# EAGLE design v1_E7 (EAGLE 7.7.0)

## Sheet 1 of 5: Atmega328p
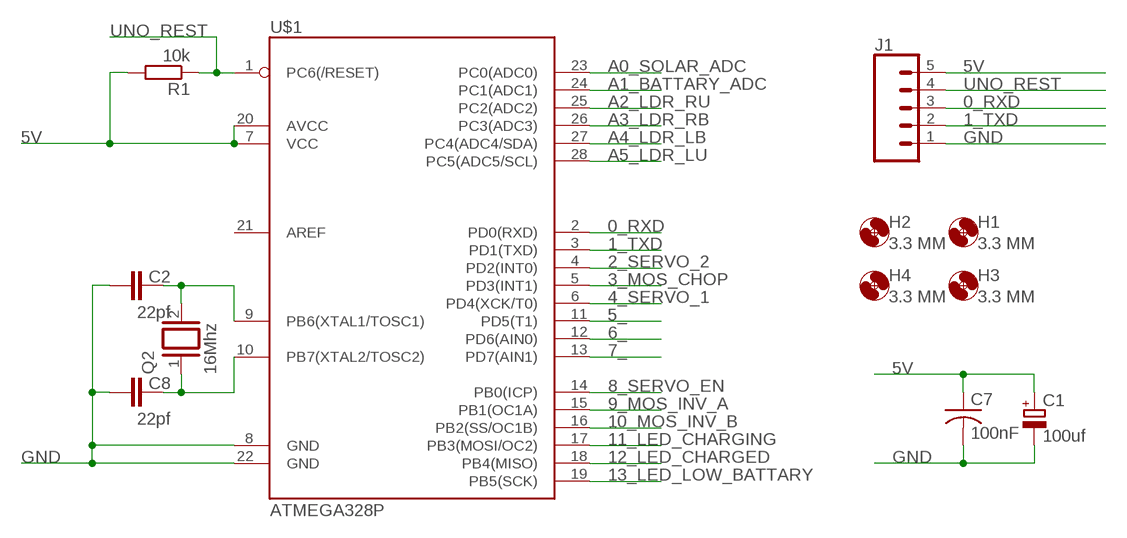
[diagram p0: schematic, sheet 1]

### Parts
C1  100uf  CPOL-EUE3.5-8  [E3,5-8]
C2  22pf  C-EU050-030X075  [C050-030X075]
C7  100nF  C-US050-035X075  [C050-035X075]
C8  22pf  C-EU050-030X075  [C050-030X075]
H1  3.3 MM  MOUNT-HOLE3.3  [3,3]
H2  3.3 MM  MOUNT-HOLE3.3  [3,3]
H3  3.3 MM  MOUNT-HOLE3.3  [3,3]
H4  3.3 MM  MOUNT-HOLE3.3  [3,3]
J1  CONN_05JST-VERT  [JST-5-PTH-VERT]
Q2  16Mhz  XTAL/S  [QS]
R1  10k  R-EU_0207/10  [0207/10]
U$1  ATMEGA328P  ATMEGA328P_PDIP  [DIL-28-3]

### Nets
0_RXD: J1.3 U$1.2(PD0(RXD))
1_TXD: J1.2 U$1.3(PD1(TXD))
2_SERVO_2: U$1.4(PD2(INT0)) ; also sheet 5
3_MOS_CHOP: U$1.5(PD3(INT1)) ; also sheet 3
4_SERVO_1: U$1.6(PD4(XCK/T0)) ; also sheet 5
5_: U$1.11(PD5(T1))
5V: C1.+ C7.1 J1.5 R1.2 U$1.7(VCC) U$1.20(AVCC) ; also sheet 2,5
6_: U$1.12(PD6(AIN0))
7_: U$1.13(PD7(AIN1))
8_SERVO_EN: U$1.14(PB0(ICP)) ; also sheet 5
9_MOS_INV_A: U$1.15(PB1(OC1A)) ; also sheet 4
10_MOS_INV_B: U$1.16(PB2(SS/OC1B)) ; also sheet 4
11_LED_CHARGING: U$1.17(PB3(MOSI/OC2)) ; also sheet 5
12_LED_CHARGED: U$1.18(PB4(MISO)) ; also sheet 5
13_LED_LOW_BATTARY: U$1.19(PB5(SCK)) ; also sheet 5
A0_SOLAR_ADC: U$1.23(PC0(ADC0)) ; also sheet 3
A1_BATTARY_ADC: U$1.24(PC1(ADC1)) ; also sheet 3
A2_LDR_RU: U$1.25(PC2(ADC2)) ; also sheet 5
A3_LDR_RB: U$1.26(PC3(ADC3)) ; also sheet 5
A4_LDR_LB: U$1.27(PC4(ADC4/SDA)) ; also sheet 5
A5_LDR_LU: U$1.28(PC5(ADC5/SCL)) ; also sheet 5
GND: C1.- C2.1 C7.2 C8.1 J1.1 U$1.8(GND) U$1.22(GND) ; also sheet 2,3,4,5
N$1: C2.2 Q2.2 U$1.9(PB6(XTAL1/TOSC1))
N$4: C8.2 Q2.1 U$1.10(PB7(XTAL2/TOSC2))
UNO_REST: J1.4 R1.1 U$1.1(PC6(/RESET))
Unconnected: U$1.21(AREF)

## Sheet 2 of 5: Voltage regulation
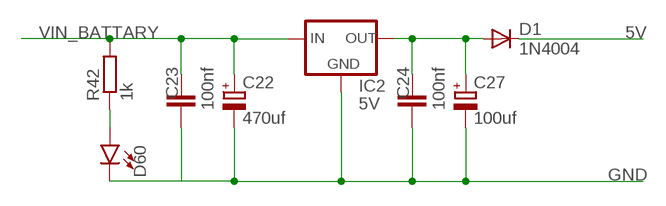
[diagram p1: schematic, sheet 2]

### Parts
C22  470uf  CPOL-EUE3.5-8  [E3,5-8]
C23  100nf  C-EU050-030X075  [C050-030X075]
C24  100nf  C-EU050-030X075  [C050-030X075]
C27  100uf  CPOL-EUE3.5-8  [E3,5-8]
D1  1N4004  [DO41-10]
D60  LED5MM  [LED_5MM]
IC2  5V  V_REG_78XXSIDE  [78XXL]
R42  1k  R-EU_0207/10  [0207/10]

### Nets
5V: D1.C ; also sheet 1,5
GND: C22.- C23.1 C24.1 C27.- D60.K(C) IC2.GND ; also sheet 1,3,4,5
N$13: C24.2 C27.+ D1.A IC2.OUT
N$74: D60.A R42.1
VIN_BATTARY: C22.+ C23.2 IC2.IN R42.2 ; also sheet 3,4,5

## Sheet 3 of 5: Buck_Boost Charging
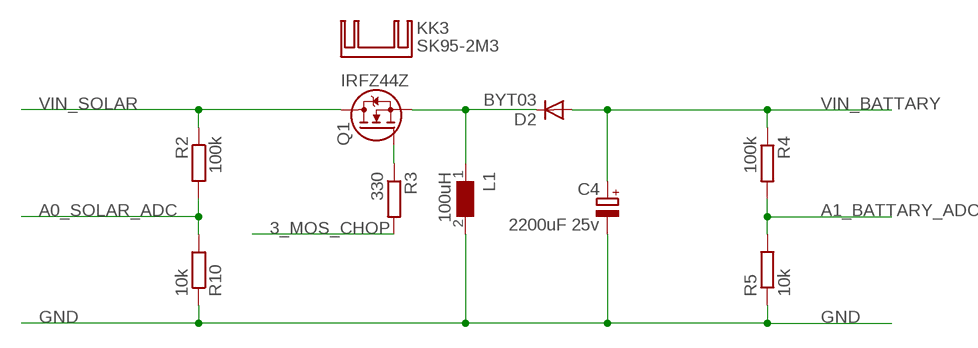
[diagram p2: schematic, sheet 3]

### Parts
C4  2200uF 25v  CPOL-EUE5-13  [E5-13]
D2  BYT03  [DO27-15]
KK3  SK95-2M3  [SK95-2M3]
L1  100uH  WE-ZB  [WE-ZB]
Q1  IRFZ44Z  [TO220V]
R2  100k  R-EU_0207/10  [0207/10]
R3  330  R-EU_0207/10  [0207/10]
R4  100k  R-EU_0207/10  [0207/10]
R5  10k  R-EU_0207/10  [0207/10]
R10  10k  R-EU_0207/10  [0207/10]

### Nets
3_MOS_CHOP: R3.2 ; also sheet 1
A0_SOLAR_ADC: R2.2 R10.2 ; also sheet 1
A1_BATTARY_ADC: R4.2 R5.2 ; also sheet 1
GND: C4.- L1.2 R5.1 R10.1 ; also sheet 1,2,4,5
N$2: D2.C L1.1 Q1.3(S)
N$3: Q1.1(G) R3.1
VIN_BATTARY: C4.+ D2.A R4.1 ; also sheet 2,4,5
VIN_SOLAR: Q1.2(D) R2.1 ; also sheet 5

## Sheet 4 of 5: Inverter
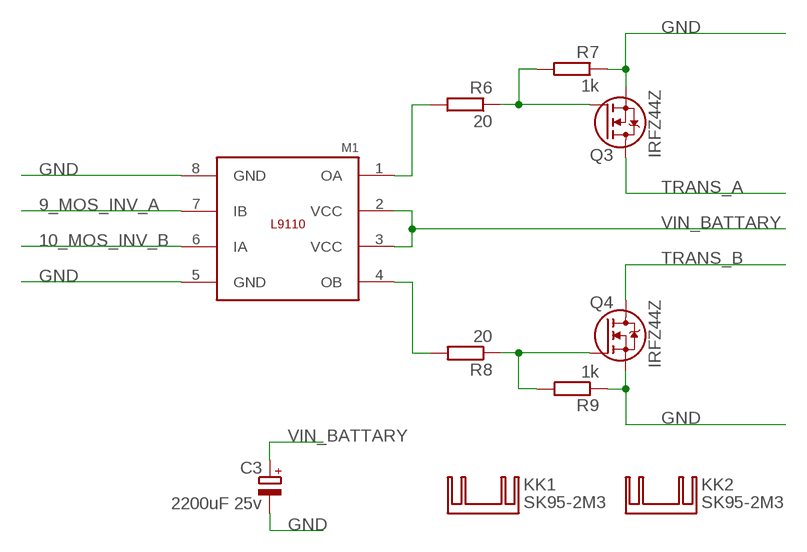
[diagram p3: schematic, sheet 4]

### Parts
C3  2200uF 25v  CPOL-EUE5-13  [E5-13]
KK1  SK95-2M3  [SK95-2M3]
KK2  SK95-2M3  [SK95-2M3]
M1  L9110  [SO8P]
Q3  IRFZ44Z  [TO220V]
Q4  IRFZ44Z  [TO220V]
R6  20  R-EU_0207/10  [0207/10]
R7  1k  R-EU_0207/10  [0207/10]
R8  20  R-EU_0207/10  [0207/10]
R9  1k  R-EU_0207/10  [0207/10]

### Nets
9_MOS_INV_A: M1.7(IB) ; also sheet 1
10_MOS_INV_B: M1.6(IA) ; also sheet 1
GND: C3.- M1.5(GND) M1.8(GND) Q3.3(S) Q4.3(S) R7.1 R9.1 ; also sheet 1,2,3,5
N$5: Q3.1(G) R6.1 R7.2
N$7: M1.4(OB) R8.2
N$8: Q4.1(G) R8.1 R9.2
N$11: M1.1(OA) R6.2
TRANS_A: Q3.2(D) ; also sheet 5
TRANS_B: Q4.2(D) ; also sheet 5
VIN_BATTARY: C3.+ M1.2(VCC) M1.3(VCC) ; also sheet 2,3,5

## Sheet 5 of 5: Terminals
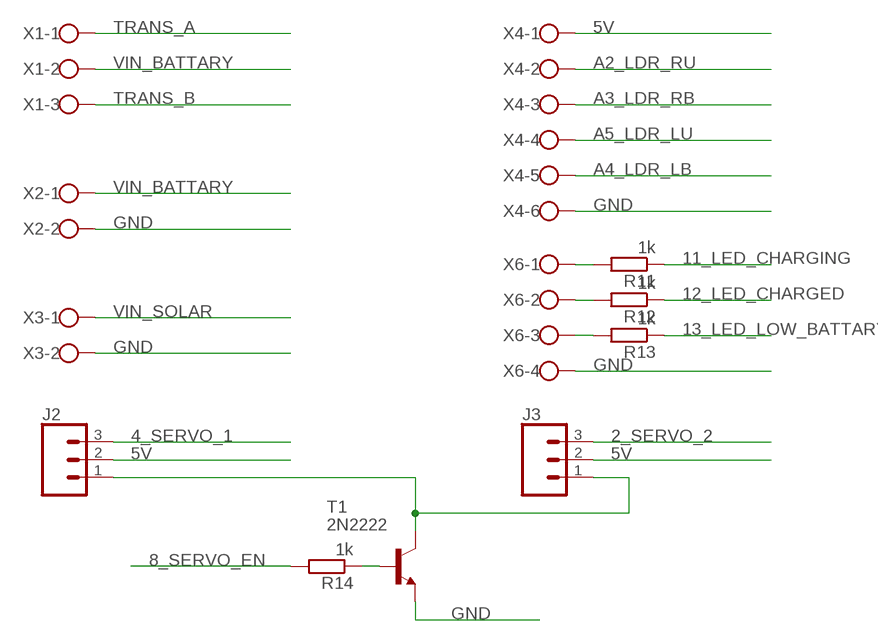
[diagram p4: schematic, sheet 5]

### Parts
J2  CONN_03JST-PTH-VERT  [JST-3-PTH-VERT]
J3  CONN_03JST-PTH-VERT  [JST-3-PTH-VERT]
R11  1k  R-EU_0207/10  [0207/10]
R12  1k  R-EU_0207/10  [0207/10]
R13  1k  R-EU_0207/10  [0207/10]
R14  1k  R-EU_0207/10  [0207/10]
T1  2N2222  [TO92-EBC-OVAL]
X1  W237-103  [W237-103]
X2  W237-102  [W237-102]
X3  W237-102  [W237-102]
X4  W237-6  [W237-6]
X6  W237-4  [W237-4]

### Nets
2_SERVO_2: J3.3 ; also sheet 1
4_SERVO_1: J2.3 ; also sheet 1
5V: J2.2 J3.2 X4.1 ; also sheet 1,2
8_SERVO_EN: R14.2 ; also sheet 1
11_LED_CHARGING: R11.1 ; also sheet 1
12_LED_CHARGED: R12.1 ; also sheet 1
13_LED_LOW_BATTARY: R13.1 ; also sheet 1
A2_LDR_RU: X4.2 ; also sheet 1
A3_LDR_RB: X4.3 ; also sheet 1
A4_LDR_LB: X4.5 ; also sheet 1
A5_LDR_LU: X4.4 ; also sheet 1
GND: T1.E X2.2 X3.2 X4.6 X6.4 ; also sheet 1,2,3,4
N$9: R13.2 X6.3
N$10: R12.2 X6.2
N$12: R11.2 X6.1
N$16: R14.1 T1.B
N$17: J2.1 J3.1 T1.C
TRANS_A: X1.1 ; also sheet 4
TRANS_B: X1.3 ; also sheet 4
VIN_BATTARY: X1.2 X2.1 ; also sheet 2,3,4
VIN_SOLAR: X3.1 ; also sheet 3

## Library data of the parts
C1 C22 C27 = rcl:CPOL-EU: POLARIZED CAPACITOR, European symbol
C2 C8 C23 C24 = rcl:C-EU: CAPACITOR, European symbol
C3 C4 = rcl@1:CPOL-EU: POLARIZED CAPACITOR, European symbol; SPICEPREFIX: C
C7 = rcl@1:C-US: CAPACITOR, American symbol; SPICEPREFIX: C
D1 = adafruit:1N4004: DIODE General purpose 1N400x type rectifier (With bigger pads) http://www.ladyada.net/library/pcb/eaglelibrary.html
D2 = diode:BYT03: DIODE ultra fast
D60 = SparkFun-LED:LED: LED (Generic) Standard schematic elements and footprints for 5mm, 3mm, 1206, and 0603 sized LEDs. Generic LEDs with no color specified.
H1-H4 = holes:MOUNT-HOLE: MOUNTING HOLE with drill center marker
IC2 = SparkFun:V_REG_78XX: Voltage Regulator Standard 7805 5V regulator. IGO (Input Ground Output). Spark Fun Electronics SKU : COM-00107
J1 = SparkFun-Connectors:CONN_05: Multi connection point. Often used as Generic Header-pin footprint for 0.1 inch spaced/style header connections On any of the 0.1 inch spaced packages, you can populate with these: Break Away Headers - Straight <https://www.sparkfun.com/products/116> (PRT-00116) Break Away Male Headers - Right Angle <https://www.sparkfun.com/products/553> (PRT-00553) Female Headers <https://www.sparkfun.com/products/115> (PRT-00115) Break Away Headers - Machine Pin <https://www.sparkfun.com/products/117> (PRT-00117) Break Away Female Headers - Swiss Machine Pin <https://www.sparkfun.com/products/743> (PRT-00743) For SCREWTERMINALS and SPRING TERMINALS visit here: Screw Terimnals on SparkFun.com <https://www.sparkfun.com/search/results?term=Screw+Terminals> (5mm/3.5mm/2.54mm spacing) This device is also useful as a general connection point to wire up your design to another part of your project. Our various solder wires solder well into these plated through hole pads. Hook-Up Wire - Assortment (Stranded, 22 AWG) <https://www.sparkfun.com/products/11375> (PRT-11375) Hook-Up Wire - Assortment (Solid Core, 22 AWG) <https://www.sparkfun.com/products/11367> (PRT-11367) View the entire wire category on our website here <https://www.sparkfun.com/categories/141> Special notes: Molex polarized connector foot print use with SKU : PRT-08231 with associated crimp pins and housings. 1MM SMD Version SKU: PRT-10208
J2 J3 = SparkFun-Connectors:CONN_03: Multi connection point. Often used as Generic Header-pin footprint for 0.1 inch spaced/style header connections On any of the 0.1 inch spaced packages, you can populate with these: Break Away Headers - Straight <https://www.sparkfun.com/products/116> (PRT-00116) Break Away Male Headers - Right Angle <https://www.sparkfun.com/products/553> (PRT-00553) Female Headers <https://www.sparkfun.com/products/115> (PRT-00115) Break Away Headers - Machine Pin <https://www.sparkfun.com/products/117> (PRT-00117) Break Away Female Headers - Swiss Machine Pin <https://www.sparkfun.com/products/743> (PRT-00743) Stackable Header - 3 Pin (Female, 0.1") <https://www.sparkfun.com/products/13875> (PRT-13875) For SCREWTERMINALS and SPRING TERMINALS visit here: Screw Terimnals on SparkFun.com <https://www.sparkfun.com/search/results?term=Screw+Terminals> (5mm/3.5mm/2.54mm spacing) This device is also useful as a general connection point to wire up your design to another part of your project. Our various solder wires solder well into these plated through hole pads. Hook-Up Wire - Assortment (Stranded, 22 AWG) <https://www.sparkfun.com/products/11375> (PRT-11375) Hook-Up Wire - Assortment (Solid Core, 22 AWG) <https://www.sparkfun.com/products/11367> (PRT-11367) View the entire wire category on our website here <https://www.sparkfun.com/categories/141> Special notes: Molex polarized connector foot print use with SKU : PRT-08232 with associated crimp pins and housings.; PROD_ID: CONN-13230
KK1-KK3 = heatsink:SK95-2M3: HEATSINK manufacturer Fischer/distributor Buerklin
L1 = wuerth_elektronik_eisos__v6.5:WE-ZB: Leaded Line Chokes WE-ZB - low leakage field because of the ring core - Delivery on a strap for easy assembly on the printed circuit board - Advanrage in comparison to the 6-hole ferrite bead is that you have a higher data safety in transmission because of aligned base inductance -- Particularly suitable for video signals -- Broadband screening -- Use in computer periphery devices such as scanners, modems, ect.
M1 = FaBo-Motor:L9110
Q1 Q3 Q4 = semiconductor:IRFZ44Z: Automotive MOSFET VDSS = 55V RDS(on) = 13.9mOhm ID = 51A
Q2 = special:XTAL/S: CRYSTAL
R1-R14 R42 = rcl:R-EU_: RESISTOR, European symbol
T1 = adafruit:2N2222: NPN TRANSISTOR Big oval pads
U$1 = FaBo-MPU:ATMEGA328P_PDIP
X1 = con-wago-500:W237-103: WAGO SCREW CLAMP; MPN: 237-103; OC_FARNELL: unknown; OC_NEWARK: 18M7116
X2 X3 = con-wago-500:W237-102: WAGO SCREW CLAMP; MPN: 237-102; OC_FARNELL: unknown; OC_NEWARK: 70K9898
X4 = con-wago-500:W237-6: WAGO SCREW CLAMP; OC_FARNELL: unknown; OC_NEWARK: unknown
X6 = con-wago-500:W237-4: WAGO SCREW CLAMP; OC_FARNELL: unknown; OC_NEWARK: unknown

## Board
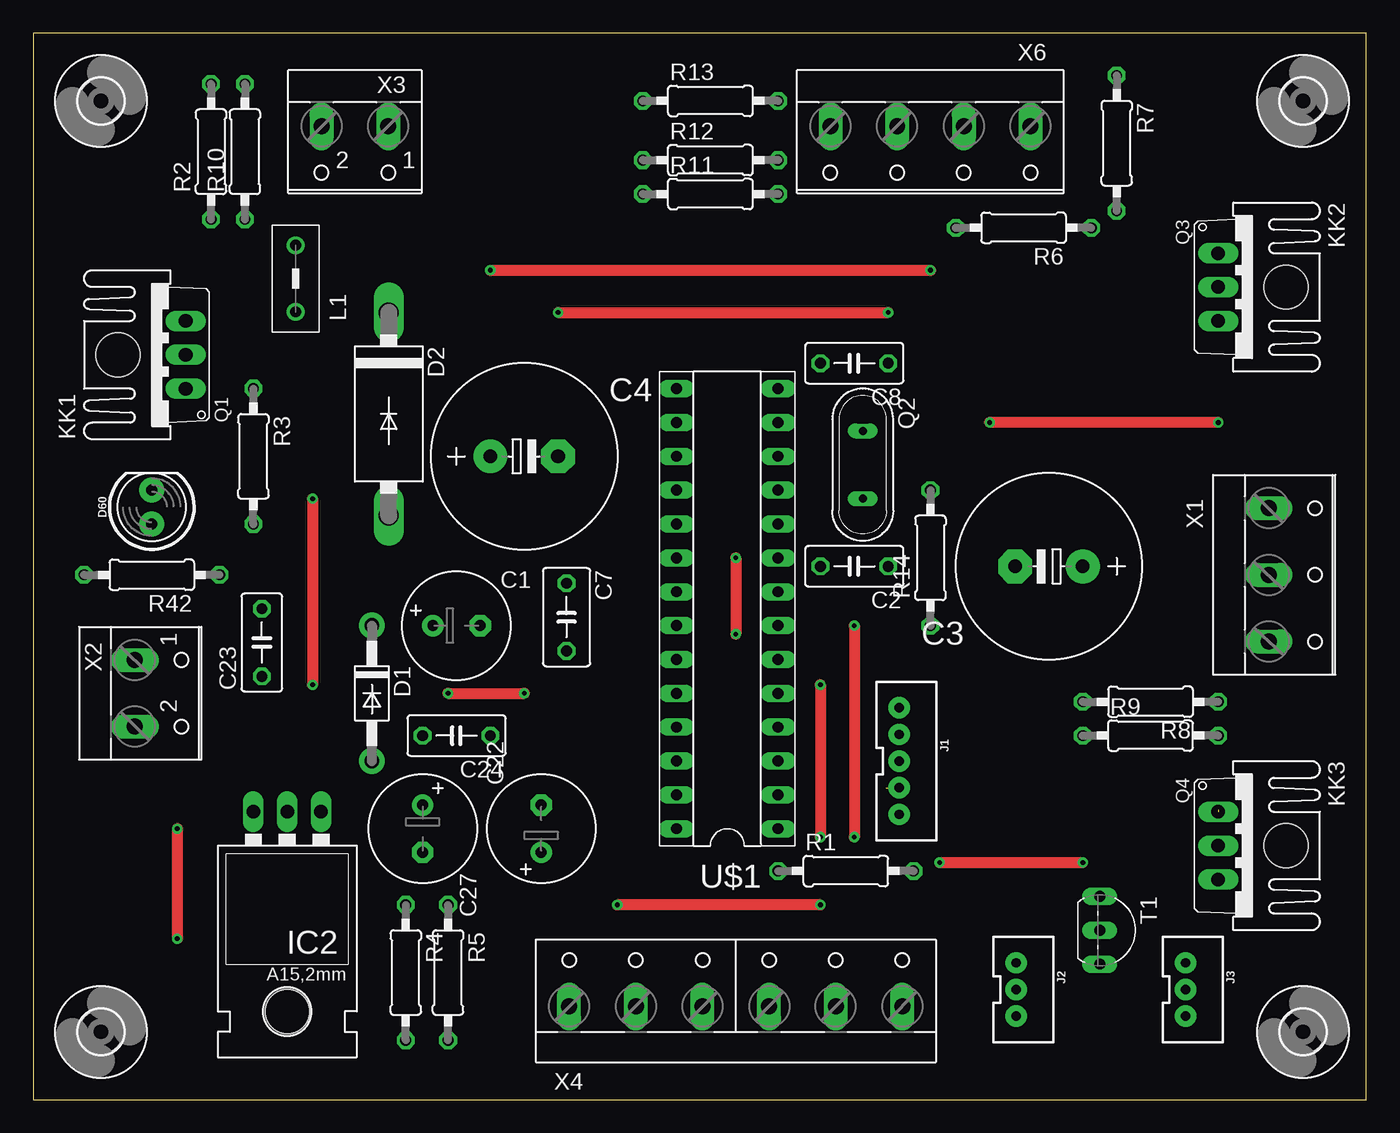
[diagram p5: board, top side]
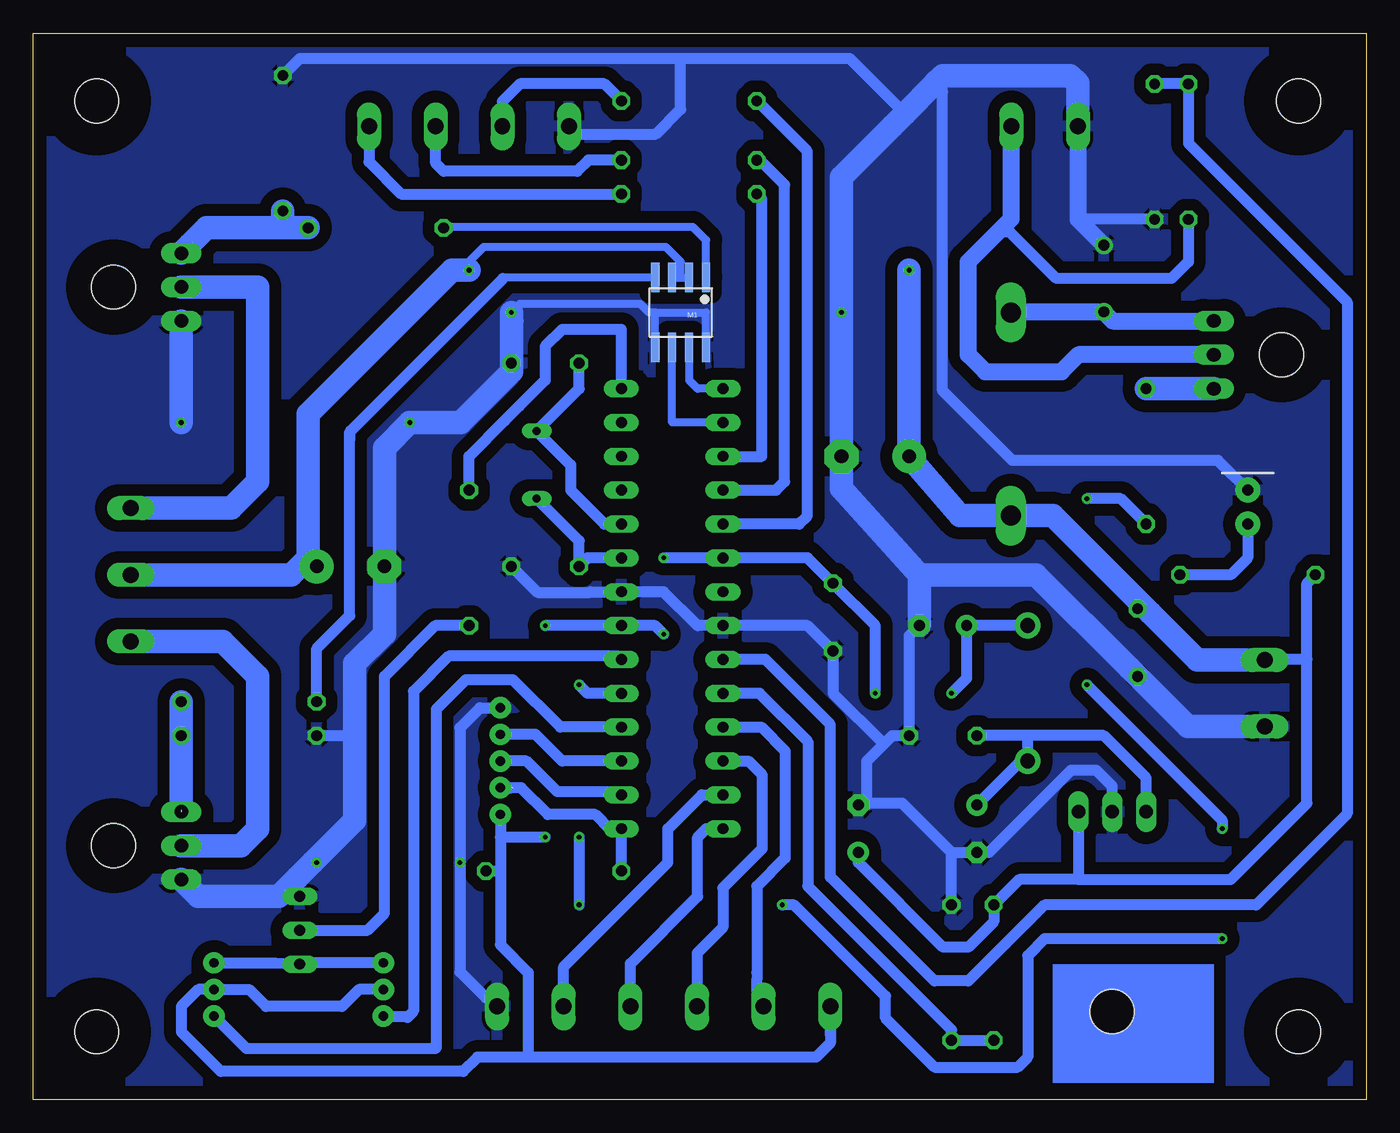
[diagram p6: board, bottom side, seen from below]

Size 100 x 80 mm. Coordinates in mm from the lower left corner, seen from the top.
Outline: 0,0 100,0 100,80 0,80 0,0
Copper layers (1*16): Top 0.035mm / dielectric 1.5mm / Bottom 0.035mm
Design rules "default *": minimum track width 6mil, minimum drill 0.35mm, track to track 35mil, track to pad 35mil, pad to pad 6mil, via to via 6mil, smd to smd 6mil, copper to edge 40mil, drill to drill 6mil, minimum pad ring 10mil, minimum via ring 8mil, stop-mask expansion 4mil, vias tented up to drill 0mil, thermal gap 10mil

### Footprints (pad centres in the part's own frame; a part is rotated, then mirrored left to right if it is on the bottom)
E3,5-8 = drill 0.813 pad 1.6: + -1.778,0 | drill 0.813 pad 1.6 octagon: - 1.778,0
C050-030X075 = drill 0.813 octagon: 1 -2.54,0; 2 2.54,0
E5-13 = drill 1.016 pad 2.54: + -2.54,0 | drill 1.016 pad 2.54 octagon: - 2.54,0
C050-035X075 = drill 0.813 octagon: 1 -2.54,0; 2 2.54,0
DO41-10 = drill 1.118 pad 1.93: A 5.08,0; C -5.08,0
DO27-15 = drill 1.499 long: A 7.62,0; C -7.62,0
LED_5MM = drill 0.813 pad 1.88: A -1.27,0; K 1.27,0
3,3 = hole 3.3: 0,0
78XXL = drill 1.016 long: GND 0,-3.81; IN -2.54,-3.81; OUT 2.54,-3.81 | hole 3.302: 0,11.176
JST-5-PTH-VERT = drill 0.7 pad 1.6: 1 -4,0.18; 2 -2,0.18; 3 0,0.18; 4 2,0.18; 5 4,0.18
JST-3-PTH-VERT = drill 0.7 pad 1.6: 1 -2,-0.55; 2 0,-0.55; 3 2,-0.55
SK95-2M3 = hole 3.302: 0,2.54
WE-ZB = drill 0.813: 1 -2.5,0; 2 2.5,0
SO8P = smd 0.61 x 2.21: 1 -1.905,-2.616; 2 -0.635,-2.616; 3 0.635,-2.616; 4 1.905,-2.616; 5 1.905,2.616; 6 0.635,2.616; 7 -0.635,2.616; 8 -1.905,2.616
TO220V = drill 1.016 long: 1 -2.54,-2.54; 2 0,-2.54; 3 2.54,-2.54
QS = drill 0.61 long: 1 -2.54,0; 2 2.54,0
0207/10 = drill 0.813 octagon: 1 -5.08,0; 2 5.08,0
TO92-EBC-OVAL = drill 0.813 long: B 0,-1.27; C 2.54,-1.27; E -2.54,-1.27
DIL-28-3 = drill 0.813 long: 1 -15.24,-3.81; 2 -12.7,-3.81; 3 -10.16,-3.81; 4 -7.62,-3.81; 5 -5.08,-3.81; 6 -2.54,-3.81; 7 0,-3.81; 8 2.54,-3.81; 9 5.08,-3.81; 10 7.62,-3.81; 11 10.16,-3.81; 12 12.7,-3.81; 13 15.24,-3.81; 14 17.78,-3.81; 15 17.78,3.81; 16 15.24,3.81; 17 12.7,3.81; 18 10.16,3.81; 19 7.62,3.81; 20 5.08,3.81; 21 2.54,3.81; 22 0,3.81; 23 -2.54,3.81; 24 -5.08,3.81; 25 -7.62,3.81; 26 -10.16,3.81; 27 -12.7,3.81; 28 -15.24,3.81
W237-103 = drill 1.194 long: 1 -5,-1.29; 2 0,-1.29; 3 5,-1.29
W237-102 = drill 1.194 long: 1 -2.5,-1.27; 2 2.5,-1.27
W237-6 = drill 1.194 long: 1 -12.5,-1.27; 2 -7.5,-1.27; 3 -2.5,-1.27; 4 2.5,-1.27; 5 7.5,-1.27; 6 12.5,-1.27
W237-4 = drill 1.194 long: 1 -7.5,-1.27; 2 -2.5,-1.27; 3 2.5,-1.27; 4 7.5,-1.27

### Placement (x,y rotation side)
C1  31.75,35.56 0 top
C2  61.59,40.01 180 top
C3  76.2,40.01 180 top
C4  36.83,48.26 0 top
C7  40.01,36.2 270 top
C8  61.59,55.24 180 top
C22  38.1,20.32 90 top
C23  17.14,34.29 90 top
C24  31.75,27.3 180 top
C27  29.21,20.32 270 top
D1  25.4,30.48 270 top
D2  26.67,51.44 270 top
D60  8.89,44.45 90 top
H1  95.25,74.93 0 top
H2  5.08,5.08 0 top
H3  95.25,5.08 0 top
H4  5.08,74.93 0 top
IC2  19.05,17.78 180 top
J1  64.77,25.4 270 top
J2  74.3,8.26 270 top
J3  87,8.26 270 top
KK1  8.89,55.88 90 top
KK2  91.44,60.96 270 top
KK3  91.44,19.05 270 top
L1  19.68,61.59 90 top
M1  51.44,59.05 180 bottom
Q1  8.89,55.88 90 top
Q2  62.23,47.62 270 top
Q3  91.44,60.96 270 top
Q4  91.44,19.05 270 top
R1  60.96,17.14 0 top
R2  13.34,71.12 90 top
R3  16.51,48.26 270 top
R4  27.94,9.53 270 top
R5  31.11,9.53 270 top
R6  74.3,65.41 180 top
R7  81.28,71.75 270 top
R8  83.82,29.84 180 top
R9  83.82,27.3 0 top
R10  15.88,71.12 90 top
R11  50.8,67.94 0 top
R12  50.8,70.48 0 top
R13  50.8,74.93 0 top
R14  67.31,40.64 90 top
R42  8.89,39.37 180 top
T1  81.28,12.7 270 top
U$1  52.07,35.56 90 top
X1  93.98,39.37 270 top
X2  8.89,30.48 270 top
X3  24.13,71.75 180 top
X4  52.7,8.26 0 top
X6  67.31,71.75 180 top

### Tracks (layer width: path | path; a pad name or v marks a point on that pad's centre or on a via)
0_RXD
  Bottom 0.813: J1.3 63,25.4 60.69,23.09 56.11,23.09 U$1.2
1_TXD
  Bottom 0.813: U$1.3 60.33,25.4 62.33,27.4 J1.2
2_SERVO_2
  Bottom 0.813: J3.3 84,3.81 69.85,3.81 69.77,3.89 69.77,29.29 67.56,31.5 64.01,31.5 60.46,27.94 U$1.4
3_MOS_CHOP  (via drill 0.35)
  Top 0.813: v20.95,45.09 v20.95,31.11 | v10.79,20.32 v10.79,12.06 | v59.05,31.11 v59.05,19.68 | v59.05,14.61 v43.81,14.61
  Bottom 0.813: R3.2 18.41,45.09 v20.95,45.09 | v10.79,12.06 24.13,12.06 25.4,10.79 25.4,3.17 26.15,2.43 32.38,2.43 36.06,6.1 36.06,7.75 42.91,14.61 v43.81,14.61 | U$1.5 58.42,30.48 v59.05,31.11 | v10.79,20.32 10.79,20.95 v20.95,31.11 | v59.05,19.68 v59.05,14.61
4_SERVO_1
  Bottom 0.813: U$1.6 56.13,33.27 68.83,33.27 71.48,30.63 71.48,6.63 71.85,6.25 | 71.85,6.25 71.94,6.16 | J2.3 71.85,6.25
5V  (via drill 0.35)
  Top 0.813: v31.11,30.48 v36.83,30.48 | v52.7,40.64 v52.7,34.92 | v61.59,35.56 v61.59,19.68
  Bottom 0.813: D1.C C1.+ 29.97,31.62 v31.11,30.48 | v52.7,40.64 U$1.20 41.91,40.64 C7.1 36.83,35.56 v36.83,30.48 | J1.5 64.86,21.3 64.95,21.3 64.95,19.68 | 64.95,19.68 64.95,17.14 | 64.95,17.14 64.95,11.61 62.87,9.53 62.87,3.17 | R1.2 64.95,17.14 | v61.59,35.56 U$1.7 53.34,35.56 v52.7,34.92 | v61.59,19.68 64.95,19.68 | 40.2,4.88 X4.1 40.2,4.25 41.27,3.17 62.87,3.17 | 62.87,3.17 66.67,3.17 67.74,2.11 85.93,2.11 88.9,5.08 88.9,6.99 87.63,8.26 J3.2 83.82,8.26 82.55,6.99 76.83,6.99 75.56,8.26 J2.2
8_SERVO_EN
  Bottom 0.813: U$1.14 55.88,57.78 60.33,57.78 61.59,56.52 61.59,53.98 63.55,52.02 63.56,52.02 64.64,50.93 67.31,48.26 R14.2
9_MOS_INV_A
  Bottom 0.61: U$1.15 50.16,53.34 50.8,53.98 M1.7
10_MOS_INV_B
  Bottom 0.61: U$1.16 52.07,50.8 M1.6
11_LED_CHARGING
  Bottom 0.813: U$1.17 45.34,48.26 45.34,67.56 R11.1
12_LED_CHARGED
  Bottom 0.813: U$1.18 44.27,45.72 43.64,46.35 43.64,68.63 45.49,70.48 R12.1
13_LED_LOW_BATTARY
  Bottom 0.813: U$1.19 42.55,43.18 41.94,43.79 41.94,71.14 R13.1
A0_SOLAR_ADC
  Bottom 0.813: U$1.23 45.09,33.02 40.2,28.13 40.2,16.7 32.38,8.89 29.84,8.89 24.13,14.61 8.26,14.61 1.42,21.44 1.42,59.84 13.34,71.75 R2.2 R10.2
A1_BATTARY_ADC
  Bottom 0.813: R4.2 R5.2 31.11,5.21 41.9,16 41.9,26.86 45.52,30.48 U$1.24
A2_LDR_RU
  Bottom 0.813: U$1.25 45.38,27.94 43.6,26.16 43.6,18.13 45.72,16.01 45.72,9.53 45.72,9.01 45.72,7.5 X4.2
A3_LDR_RB
  Bottom 0.813: U$1.26 46.35,25.4 45.3,24.35 45.3,18.83 48.26,15.88 48.26,12.92 50.2,10.97 X4.3
A4_LDR_LB
  Bottom 0.813: U$1.27 49.85,22.86 52.39,20.32 52.39,17.78 60.2,9.96 X4.5
A5_LDR_LU
  Bottom 0.813: U$1.28 49.53,20.32 50.16,19.68 50.16,15.24 55.2,10.2 X4.4
GND  (via drill 0.35)
  Top 0.813: v39.37,59.05 v64.14,59.05 | v88.9,50.8 v71.75,50.8 | v68,17.78 v78.74,17.78
  Bottom 0.61: M1.5 53.34,59.05 | M1.8 49.53,59.05 53.34,59.05 | 63.5,58.42 v64.14,59.05 63.5,59.69 54.46,59.69 53.82,59.05 53.34,59.05 | C23.1 17.78,32.38
  Bottom 0.813: C1.- 34.29,34.8 C24.1 35.56,27.3 36.2,26.67 | R10.1 21.63,66.04 | 31.11,18.54 C27.- 28.31,18.54 22.16,24.7 20.25,24.7 19.05,23.5 IC2.GND | D60.K 11.12,47.95 26.55,47.95 31.77,53.17 31.77,75.59 | 37.47,22.1 37.47,25.4 36.2,26.67 | R5.1 31.11,18.54 | X4.6 66.04,7.62 68,9.58 v68,17.78 68,27.89 66.48,29.4 J1.1 | C22.- 37.47,22.1 | 36.2,26.67 40.01,30.48 C7.2 41.91,35.56 U$1.22 50.16,35.56 52.7,38.1 U$1.8 58.19,38.1 58.24,38.05 62.18,38.05 C2.1 | 31.75,76.2 31.77,76.17 31.77,75.59 | 31.77,75.59 32.38,76.2 | R7.1 80.01,78.11 51.44,78.11 | 51.44,78.11 38.73,78.11 34.61,73.98 | 35.56,73.03 36.2,73.03 35.56,73.66 | 85.17,15.15 85.09,15.24 | C8.1 v64.14,59.05 | 75.56,27.3 75.88,27.3 R9.1 | 51.44,78.11 51.44,74.3 53.29,72.44 59.23,72.44 X6.4 | v78.74,17.78 79.06,17.78 | 31.11,18.54 34.8,22.23 37.34,22.23 37.47,22.1 | 81.6,15.24 T1.E 80.17,15.4 80.17,16.67
  Bottom 1.27: X3.2 21.63,66.04 L1.2
  Bottom 1.778: X2.2 13.38,27.98 17.78,32.38 24.77,39.37 33.53,39.37 | C1.- 33.53,39.37 | 33.53,39.37 39.37,45.85 C4.- v39.37,59.05 39.37,69.22 35.56,73.03 34.61,73.98 32.38,76.2 31.75,76.83 22.23,76.83 21.63,76.24 X3.2 | Q3.3 v88.9,50.8 | Q4.3 87.63,15.24 85.09,15.24 81.6,15.24 80.17,16.67 79.06,17.78 75.88,20.95 75.88,27.3 75.88,32.7 73.66,34.92 C3.- 73.66,48.9 v71.75,50.8 67.94,50.8 64.14,54.61 v64.14,59.05
  pour Bottom: 8.26,80.01 99.69,79.38 99.69,-0.64 25.4,0 25.4,15.88 9.53,16.51 0.64,26.67 0,80.01
N$1
  Bottom 0.813: U$1.9 58.42,40.64 C2.2 59.05,41.91 Q2.2
N$2
  Bottom 1.27: Q1.3 19.01,58.42 L1.1 26.63,59.09
  Bottom 1.778: 26.63,59.09 D2.C
N$3
  Bottom 1.778: R3.1 Q1.1
N$4
  Bottom 0.813: C8.2 59.05,53.34 Q2.1 59.69,47.62 59.69,45.72 57.15,43.18 U$1.10
N$5
  Bottom 1.778: 81.28,65.41 R7.2 | 88.27,64.14 Q3.1 87,65.41 81.28,65.41 | R6.1 81.28,65.41
N$6
  pour Bottom: 0,23.5 8.26,14.61 22.86,13.97 22.23,0 0,0
N$7
  Bottom 0.61: M1.4 64.69,61.67 64.77,61.59
  Bottom 0.813: 76.2,50.16 64.77,61.59 | 76.26,49.54 76.2,50.16 | 76.26,49.54 76.26,36.31 78.74,33.83 R8.2 | 76.26,49.54 76.26,50.11 76.2,50.16
N$8  (1 unrouted)
  Bottom 1.778: R8.1 R9.2 88.9,21.72
N$9
  Bottom 0.813: X6.3 64.81,74.89 63.5,76.2 57.15,76.2 R13.2
N$10
  Bottom 0.813: R12.2 58.36,70.48 59.2,69.65 69.22,69.65 69.81,70.24 X6.2
N$11
  Bottom 0.61: M1.1 49.53,64.48 50.51,65.47 69.15,65.47 R6.2
N$12
  Bottom 0.813: R11.2 72.39,67.94 74.81,70.36 X6.1
N$13
  Bottom 0.813: IC2.OUT 16.51,24.13 19.68,27.3 25.4,27.3 | 25.4,27.3 C24.2 | 25.4,27.3 D1.A 25.91,25.4 C27.+
N$16
  Bottom 0.813: R14.1 69.85,35.56 73.66,31.75 73.66,13.97 74.93,12.7 T1.B
N$17
  Bottom 0.813: T1.C 81.82,10.26 J3.1 | T1.C 79.82,10.35 | J2.1 79.92,10.26 T1.C
N$74
  Bottom 0.813: D60.A 8.89,40.64 10.16,39.37 R42.1
TRANS_A
  Bottom 1.778: Q3.2 83.19,60.96 83.19,46.35 85.17,44.37 X1.1
TRANS_B
  Bottom 1.778: Q4.2 84.45,19.05 83.19,20.32 83.19,31.75 85.81,34.37 X1.3
UNO_REST  (1 unrouted)
  Bottom 0.813: J1.4 64.14,23.4 | R1.1 U$1.1 56.77,20.32 57.83,21.39 61.39,21.39 63.41,23.4 63.99,23.4
VIN_BATTARY  (via drill 0.35)
  Top 0.813: v34.29,62.23 v67.31,62.23
  Bottom 0.61: M1.3 51.44,61.67 | 51.44,61.67 M1.2 | 51.44,61.67 51.44,62.87 52.54,63.97 66.2,63.97 67.31,62.87 v67.31,62.23 | C23.2 16.51,36.83 16.19,36.51
  Bottom 0.813: IC2.IN 21.59,16.51 | 21.59,16.51 10.16,16.51 4.45,22.23 4.45,33.02 | 4.45,33.02 7.58,33.02 X2.1 | 4.45,33.02 4.45,38.73 R42.2 | 21.59,16.51 26.04,16.51 R4.1 27.94,13.34 29.84,11.43 31.75,11.43 38.1,17.78 C22.+
  Bottom 1.778: X2.1 12.66,32.98 16.19,36.51 23.5,43.81 D2.A 30.48,43.81 C4.+ v34.29,62.23 | v67.31,62.23 68.58,62.23 79.38,51.44 79.38,40.64 | 79.38,40.64 C3.+ | 79.38,40.64 80.64,39.37 X1.2
VIN_SOLAR
  Bottom 0.813: R2.1 13.34,62.87 14.61,61.59 23.23,61.59 26.73,65.09 27.62,65.09
  Bottom 1.27: Q1.2 21.59,55.88 22.86,54.61 28.57,54.61 29.84,55.88 29.84,62.87 27.62,65.09 26.63,66.08 X3.1
(copper drawn outside any net)
  shapes: Bottom area x1

### Text on the board
tDocu: SOLAR / - + | GND / LOW / CHRGD / CHRGNG | 12V | 19-12 V1 | LEDs | Solar Cell / Tracker / Dr-Essam Nabil | 9V | GND / TXD / RXD / REST / 5V | AC COM AC | 9V | Battary / - + | 5V / RU / RB / LU / LB / GND | LDRs | 12V | SERVOs